# EAGLE design Carriage Board_24V (EAGLE 9.1.3)
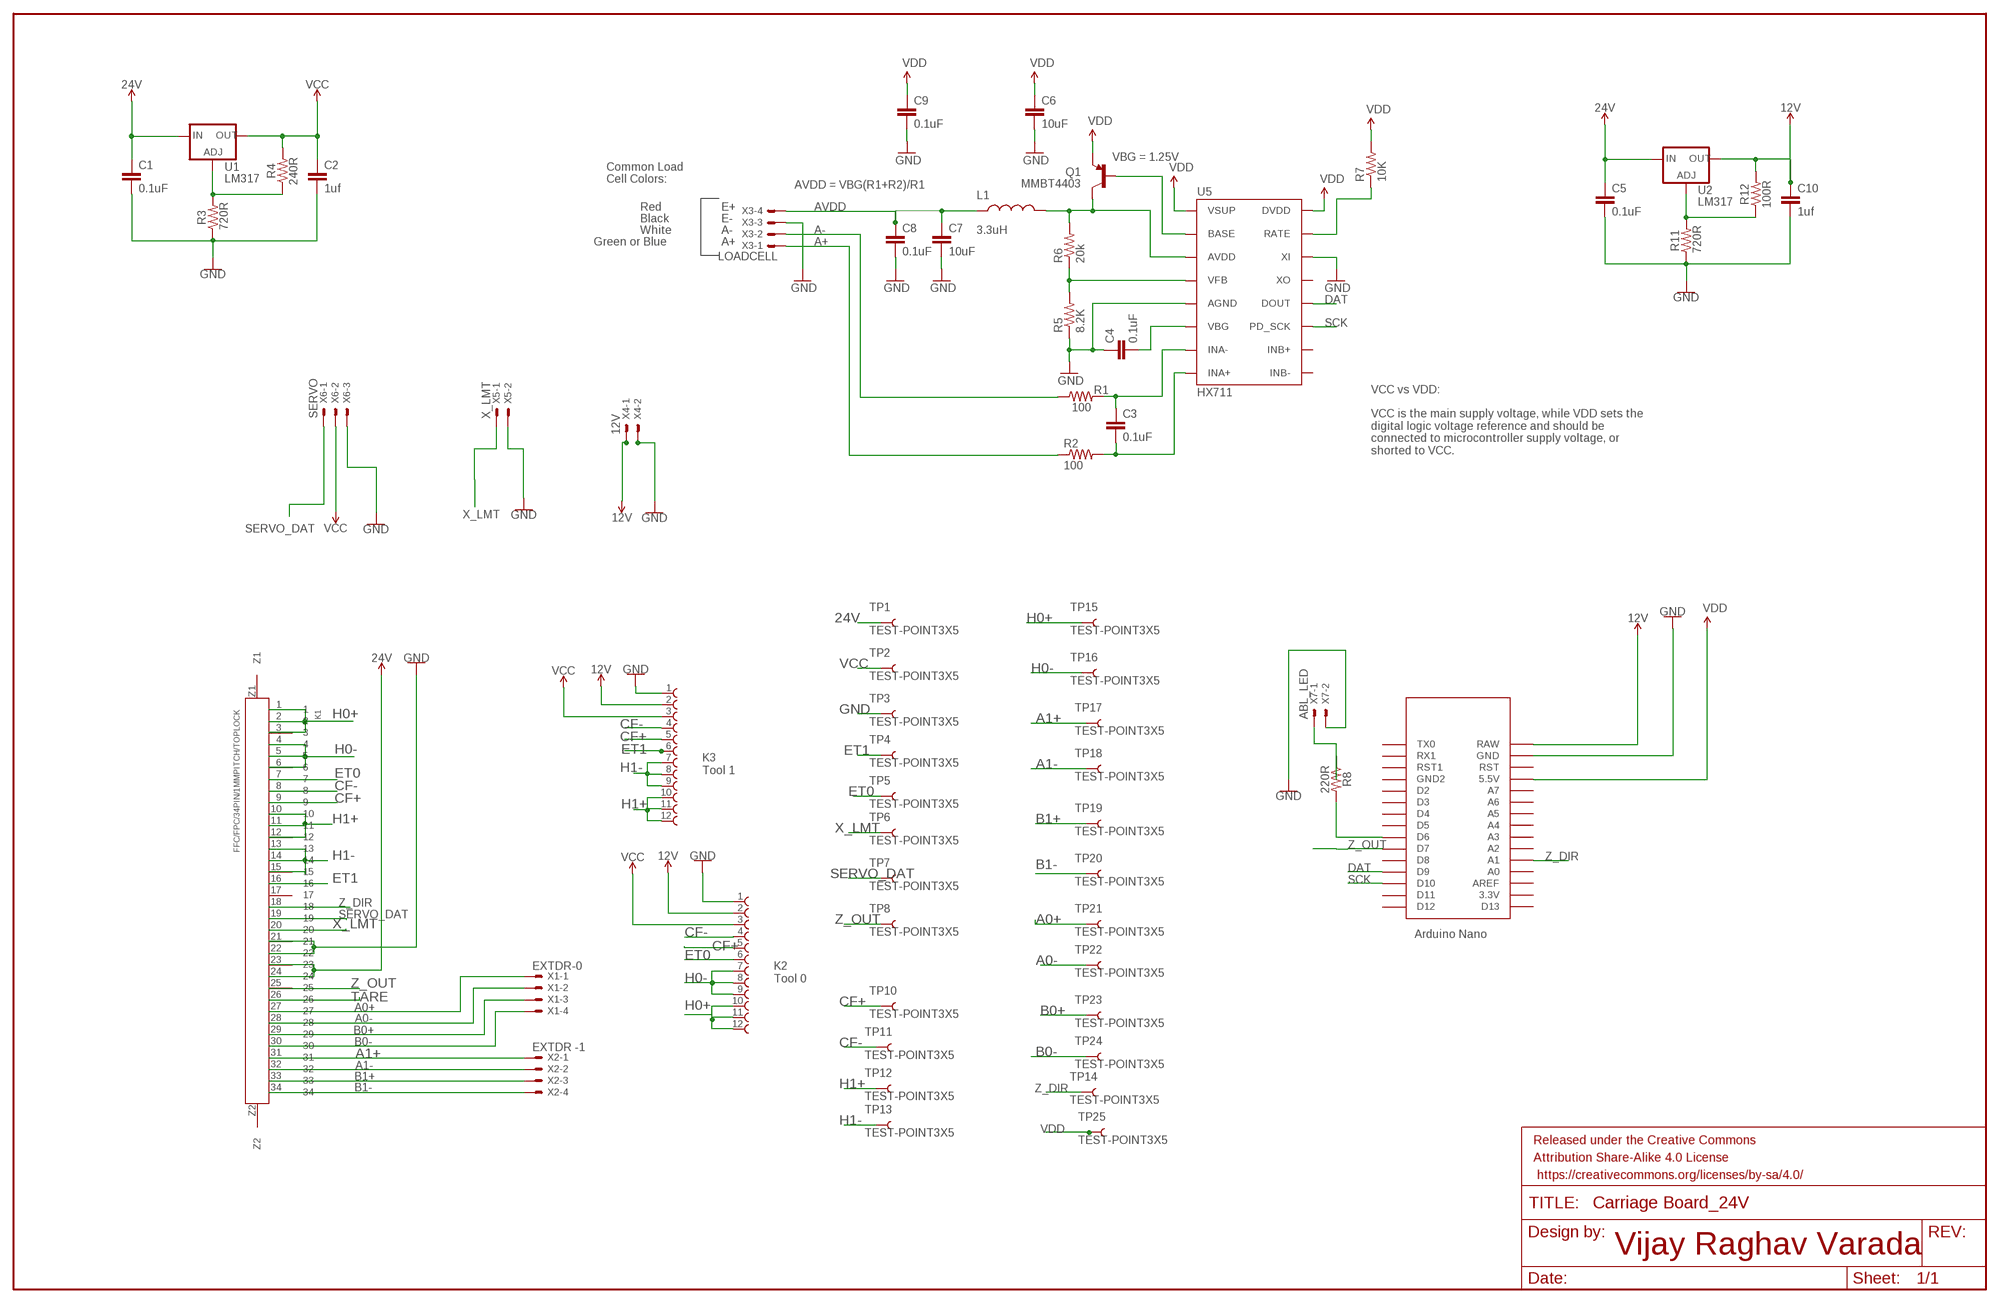
[diagram p0: schematic, sheet 1]

## Parts
C1  0.1uF  9.0PF-0603-50V-10%  [0603]
C2  1uf  9.0PF-0603-50V-10%  [0603]
C3  0.1uF  0.1UF-25V-5%(0603)  [0603-CAP]
C4  0.1uF  0.1UF-25V-5%(0603)  [0603-CAP]
C5  0.1uF  9.0PF-0603-50V-10%  [0603]
C6  10uF  10UF50V20%(1210)  [1210]
C7  10uF  10UF50V20%(1210)  [1210]
C8  0.1uF  0.1UF-25V-5%(0603)  [0603-CAP]
C9  0.1uF  0.1UF-25V-5%(0603)  [0603-CAP]
C10  1uf  9.0PF-0603-50V-10%  [0603]
FRAME1  FRAME-LEDGER  [CREATIVE_COMMONS]
K1  FFC/FPC/34PIN/1MMPITCH/TOPLOCK  [34PIN/1MMPITCH/FFC/FPC]
K2  Tool 0  68611214122  [68611214122]
K3  Tool 1  68611214122  [68611214122]
L1  3.3uH  INDUCTOR0805-IND  [0805]
Q1  MMBT4403  TRANSISTOR_PNPMMBT4403  [SOT23-3]
R1  100  100OHM-1/10W-1%(0603)  [0603-RES]
R2  100  100OHM-1/10W-1%(0603)  [0603-RES]
R3  720R  RESISTOR0603  [0603]
R4  240R  RESISTOR0603  [0603]
R5  8.2K  8.2KOHM-1/10W-5%(0603)  [0603-RES]
R6  20k  20KOHM1/10W1%(0603)  [0603-RES]
R7  10K  10KOHM-1/10W-1%(0603)0603  [0603-RES]
R8  220R  RESISTOR0603  [0603]
R11  720R  RESISTOR0603  [0603]
R12  100R  RESISTOR0603  [0603]
TP1  TEST-POINT3X5  [PAD.03X.05]
TP2  TEST-POINT3X5  [PAD.03X.05]
TP3  TEST-POINT3X5  [PAD.03X.05]
TP4  TEST-POINT3X5  [PAD.03X.05]
TP5  TEST-POINT3X5  [PAD.03X.05]
TP6  TEST-POINT3X5  [PAD.03X.05]
TP7  TEST-POINT3X5  [PAD.03X.05]
TP8  TEST-POINT3X5  [PAD.03X.05]
TP10  TEST-POINT3X5  [PAD.03X.05]
TP11  TEST-POINT3X5  [PAD.03X.05]
TP12  TEST-POINT3X5  [PAD.03X.05]
TP13  TEST-POINT3X5  [PAD.03X.05]
TP14  TEST-POINT3X5  [PAD.03X.05]
TP15  TEST-POINT3X5  [PAD.03X.05]
TP16  TEST-POINT3X5  [PAD.03X.05]
TP17  TEST-POINT3X5  [PAD.03X.05]
TP18  TEST-POINT3X5  [PAD.03X.05]
TP19  TEST-POINT3X5  [PAD.03X.05]
TP20  TEST-POINT3X5  [PAD.03X.05]
TP21  TEST-POINT3X5  [PAD.03X.05]
TP22  TEST-POINT3X5  [PAD.03X.05]
TP23  TEST-POINT3X5  [PAD.03X.05]
TP24  TEST-POINT3X5  [PAD.03X.05]
TP25  TEST-POINT3X5  [PAD.03X.05]
U1  LM317  V_REG_317SMD  [SOT223]
U2  LM317  V_REG_317SMD  [SOT223]
U5  HX711  HX711HX711  [SO16]
U$1  NANO  [NANO]
X1  EXTDR-0  JST-XH-04-PIN-LONG-PAD  [JST-XH-04-PACKAGE-LONG-PAD]
X2  EXTDR -1  JST-XH-04-PIN-LONG-PAD  [JST-XH-04-PACKAGE-LONG-PAD]
X3  LOADCELL  JST-XH-04-PIN-LONG-PAD  [JST-XH-04-PACKAGE-LONG-PAD]
X4  12V  JST-XH-02-PIN-LONG-PAD  [JST-XH-02-PACKAGE-LONG-PAD]
X5  X_LMT  JST-XH-02-PIN-LONG-PAD  [JST-XH-02-PACKAGE-LONG-PAD]
X6  SERVO  JST-XH-03-PIN-LONG-PAD  [JST-XH-03-PACKAGE-LONG-PAD]
X7  ABL_LED  JST-XH-02-PIN-LONG-PAD  [JST-XH-02-PACKAGE-LONG-PAD]

## Nets
12V: C10.1 R12.2 U2.2(OUT) U$1.RAW
24V: C1.1 C5.1 K1.23 K1.24 K2.2 K3.2 TP1.P$1 U1.3(IN) U2.3(IN) X4.1 ; supply symbol labelled 12V
A0+: K1.27 TP21.P$1 X1.1
A0-: K1.28 TP22.P$1 X1.2
A1+: K1.31 TP17.P$1 X2.1
A1-: K1.32 TP18.P$1 X2.2
A+: R2.1 X3.1
A-: R1.1 X3.2
ADJ: R3.2 R4.1 U1.1(ADJ)
ADJ1: R11.2 R12.1 U2.1(ADJ)
AVDD: C7.1 C8.1 L1.1 X3.4
B0+: K1.29 TP23.P$1 X1.3
B0-: K1.30 TP24.P$1 X1.4
B1+: K1.33 TP19.P$1 X2.3
B1-: K1.34 TP20.P$1 X2.4
CF+: K1.9 K2.5 K3.5 TP10.P$1
CF-: K1.8 K2.4 K3.4 TP11.P$1
DAT: U5.12(DOUT) U$1.D9
ET0: K1.7 K2.6 TP5.P$1
ET1: K1.16 K3.6 TP4.P$1
GND: C1.2 C2.2 C4.1 C5.2 C6.2 C7.2 C8.2 C9.2 C10.2 K1.21 K1.22 K2.1 K3.1 R3.1 R5.1 R11.1 TP3.P$1 U5.5(AGND) U5.14(XI) U$1.GND X3.3 X4.2 X5.2 X6.3 X7.2
H0+: K1.1 K1.2 K1.3 K2.10 K2.11 K2.12 TP15.P$1
H0-: K1.4 K1.5 K1.6 K2.7 K2.8 K2.9 TP16.P$1
H1+: K1.10 K1.11 K1.12 K3.10 K3.11 K3.12 TP12.P$1
H1-: K1.13 K1.14 K1.15 K3.7 K3.8 K3.9 TP13.P$1
N$1: R8.2 U$1.D6
N$2: R7.1 U5.15(RATE)
N$3: C3.1 R1.2 U5.7(INA-)
N$4: Q1.1(B) U5.2(BASE)
N$5: L1.2 Q1.3(C) R6.2 U5.3(AVDD)
N$6: R5.2 R6.1 U5.4(VFB)
N$7: C4.2 U5.6(VBG)
N$8: C3.2 R2.2 U5.8(INA+)
N$14: R8.1 X7.1
SCK: U5.11(PD_SCK) U$1.D10
SERVO_DAT: K1.19 TP7.P$1 X6.1
TARE: K1.26
VCC: C2.1 K2.3 K3.3 R4.2 TP2.P$1 U1.2(OUT) X6.2
VDD: C6.1 C9.1 Q1.2(E) R7.2 TP25.P$1 U5.1(VSUP) U5.16(DVDD) U$1.5V(5.5V)
X_LMT: K1.20 TP6.P$1 X5.1
Z_DIR: K1.18 TP14.P$1 U$1.A1
Z_OUT: K1.25 TP8.P$1 U$1.D7
Unconnected: K1.17 K1.Z1 K1.Z2 U5.9(INB-) U5.10(INB+) U5.13(XO) U$1.3.3V U$1.A0 U$1.A2 U$1.A3 U$1.A4 U$1.A5 U$1.A6 U$1.A7 U$1.AREF U$1.D2 U$1.D3 U$1.D4 U$1.D5 U$1.D8 U$1.D11 U$1.D12 U$1.D13 U$1.GND1(GND2) U$1.ICSP1 U$1.ICSP2 U$1.ICSP3 U$1.ICSP4 U$1.ICSP5 U$1.ICSP6 U$1.RST U$1.RST1 U$1.RX1 U$1.TX0

## Notes on the sheet
- VBG = 1.25V
- Common Load
  Cell Colors:
- AVDD = VBG(R1+R2)/R1
- Red | E+
- Black | E-
- White | A-
- Green or Blue | A+
- VCC vs VDD:
  
  VCC is the main supply voltage, while VDD sets the
  digital logic voltage reference and should be
  connected to microcontroller supply voltage, or
  shorted to VCC.
- Vijay Raghav Varada
- C:/Users/Vijay/Dropbox/FracktalWorks/Design & Marketing Colaterals/Box Logo.bmp | C:/Users/Vijay/Dropbox/FracktalWorks/Design & Marketing Colaterals/Box Logo.bmp

## Library data of the parts
C1 C2 C5 C10 = SparkFun-Capacitors:9.0PF: 9.0pF ceramic capacitors A capacitor is a passive two-terminal electrical component used to store electrical energy temporarily in an electric field.; PROD_ID: CAP-09341; VALUE: 9.0pF
C3 C4 C8 C9 = SparkFun-Capacitors:0.1UF-25V-5%(0603): CAP-08604; PROD_ID: CAP-08604
C6 C7 = SparkFun-Capacitors:10UF50V20%(1210): CAP-09824; PROD_ID: CAP-09824
FRAME1 = SparkFun-Aesthetics:FRAME-LEDGER: Schematic Frame - Ledger Standard 11x14 US Ledger frame
K1 = FracktalWorks_Eagle_Library:FFC/FPC/34PIN/1MMPITCH/TOPLOCK
K2 K3 = Wurth_Elektronik_Electromechanic_FPC_Connectors_&_Flat_Flexible_Cable_rev15b:68611214122: WR-FPC 1.00mm SMT ZIF Horizontal Top Contact, 12 Pins=>Code : Con_FPC_ZIF_1.00_68611214122 <http://katalog.we-online.de/media/images/eican/Con_FPC_ZIF_1.00_6861xx14122_pf2.jpg> Details see: http://katalog.we-online.de/en/em/686_1xx_141_22 Created 2014-07-09, Karrer Zheng 2014 (C) Würth Elektronik
L1 = SparkFun-Passives:INDUCTOR: Inductors Basic Inductor/Choke - 0603 and 1206. Footprints are not proven and vary greatly between part numbers. INDUCTOR POWER 3.3UH 4.0A SMD 0.197" L x 0.197" W x 0.177" H (5.00mm x 5.00mm x 4.50mm); PROD_ID: NDUC-13076
Q1 = SparkFun-DiscreteSemi:TRANSISTOR_PNP: Generic PNP BJT Double check pinouts against datasheets- not all devices are the same! MMBT3906 - 40V 200mA SOT-23 (TRANS-08052) MMBT4403 - 40V 600mA SOT-23 (TRANS-09245); PROD_ID: TRANS-09245
R1 R2 = SparkFun-Resistors:100OHM-1/10W-1%(0603): RES-07863; PROD_ID: RES-07863
R3 R4 R8 R11 R12 = SparkFun-Resistors:RESISTOR: Generic Resistor Package
R5 = SparkFun-Resistors:8.2KOHM-1/10W-5%(0603): RES-10646; PROD_ID: RES-10646
R6 = SparkFun-Resistors:20KOHM1/10W1%(0603): RES-09383; PROD_ID: RES-09383
R7 = SparkFun-Resistors:10KOHM-1/10W-1%(0603): RES-00824; PROD_ID: RES-00824
TP1-TP8 TP10-TP25 = SparkFun-Connectors:TEST-POINT: SparkFun Test Points Bare copper test points for troubleshooting or In-Circuit-Testing. These are used by our Production team for verifying production board runs using pogo-pins on test beds. SparkFun Products: SparkFun LSM9DS1 Breakout <https://www.sparkfun.com/products/13284> SparkFun PSOC <https://www.sparkfun.com/products/13714> SparkFun Load Cell Amplifier <https://www.sparkfun.com/products/13879>
U1 U2 = SparkFun-IC-Power:V_REG_317: Voltage Regulator Standard LM317 adjustable voltage regulator. AOI (Adjust Output Input). Google 'LM317 Calculator' for easy to use app to get the two resistor values needed. 240/720 for 5V output. 240/390 for 3.3V output. Spark Fun Electronics SKU : COM-00527
U5 = Testing:HX711; PROD_ID: IC-12445
U$1 = Arduino-clone:NANO: Arduino Nano
X1-X3 = Rembrandt Electronics - JST XH Connectors v1-0:JST-XH-04-PIN: JST XH Connector 2 Pin Wire to board connector. Pitch: 2,54 mm, (0.100") Number of pins: 4 Created by Rembrandt Electronics www.rembrandtelectronics.com
X4 X5 X7 = Rembrandt Electronics - JST XH Connectors v1-0:JST-XH-02-PIN: JST XH Connector 2 Pin Wire to board connector. Pitch: 2,54 mm, (0.100") Number of pins: 2 Created by Rembrandt Electronics www.rembrandtelectronics.com
X6 = Rembrandt Electronics - JST XH Connectors v1-0:JST-XH-03-PIN: JST XH Connector 2 Pin Wire to board connector. Pitch: 2,54 mm, (0.100") Number of pins: 3 Created by Rembrandt Electronics www.rembrandtelectronics.com

## Board
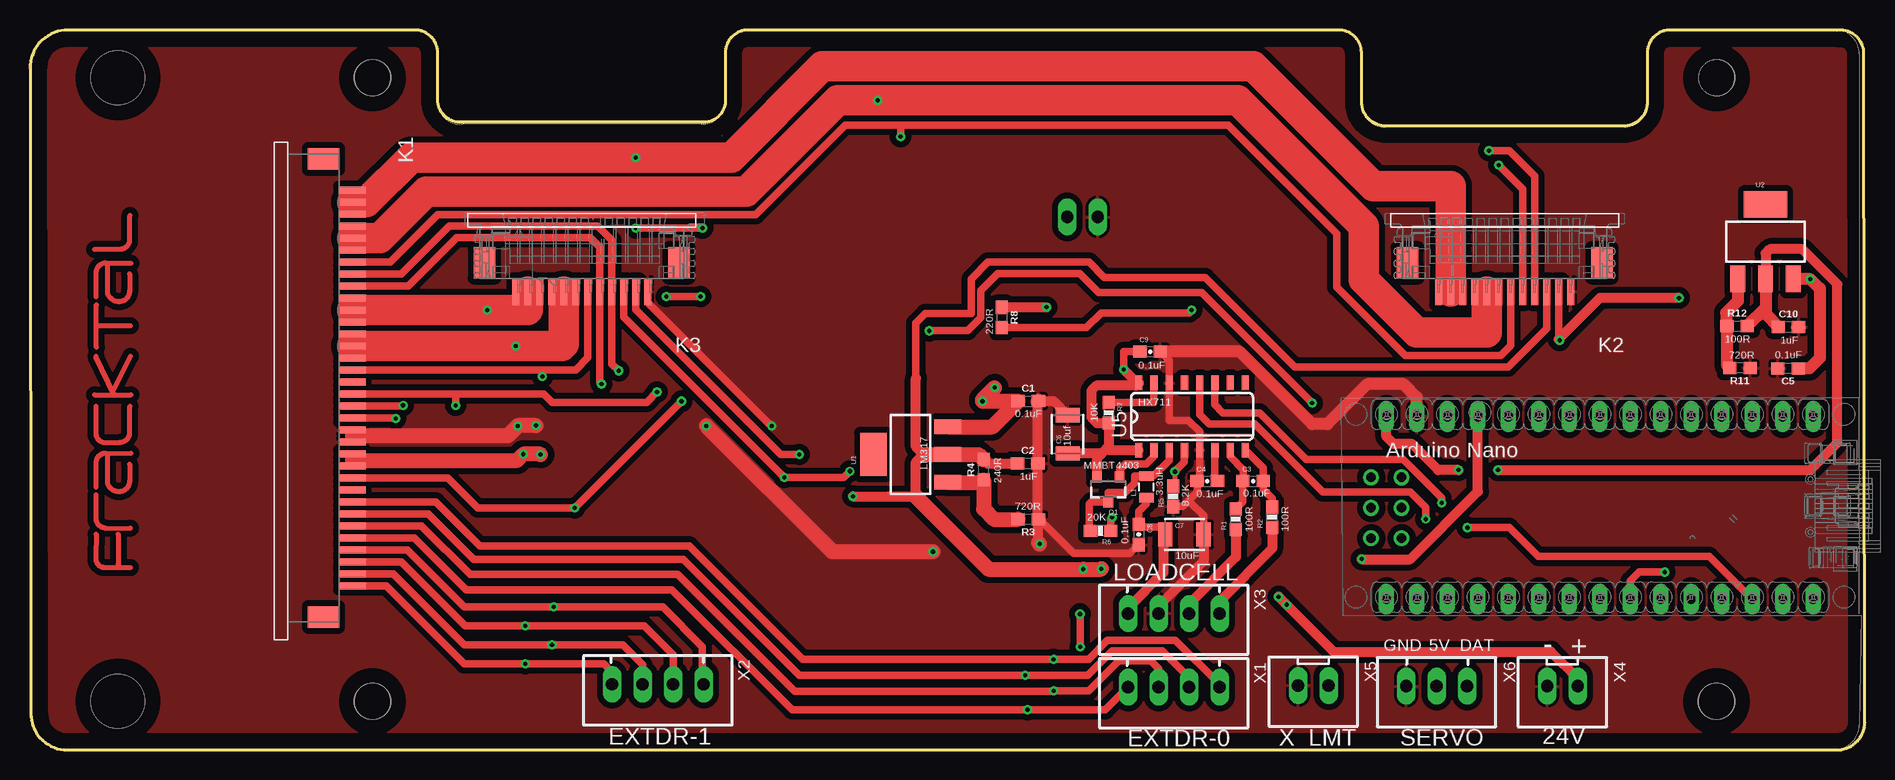
[diagram p1: board, top side]
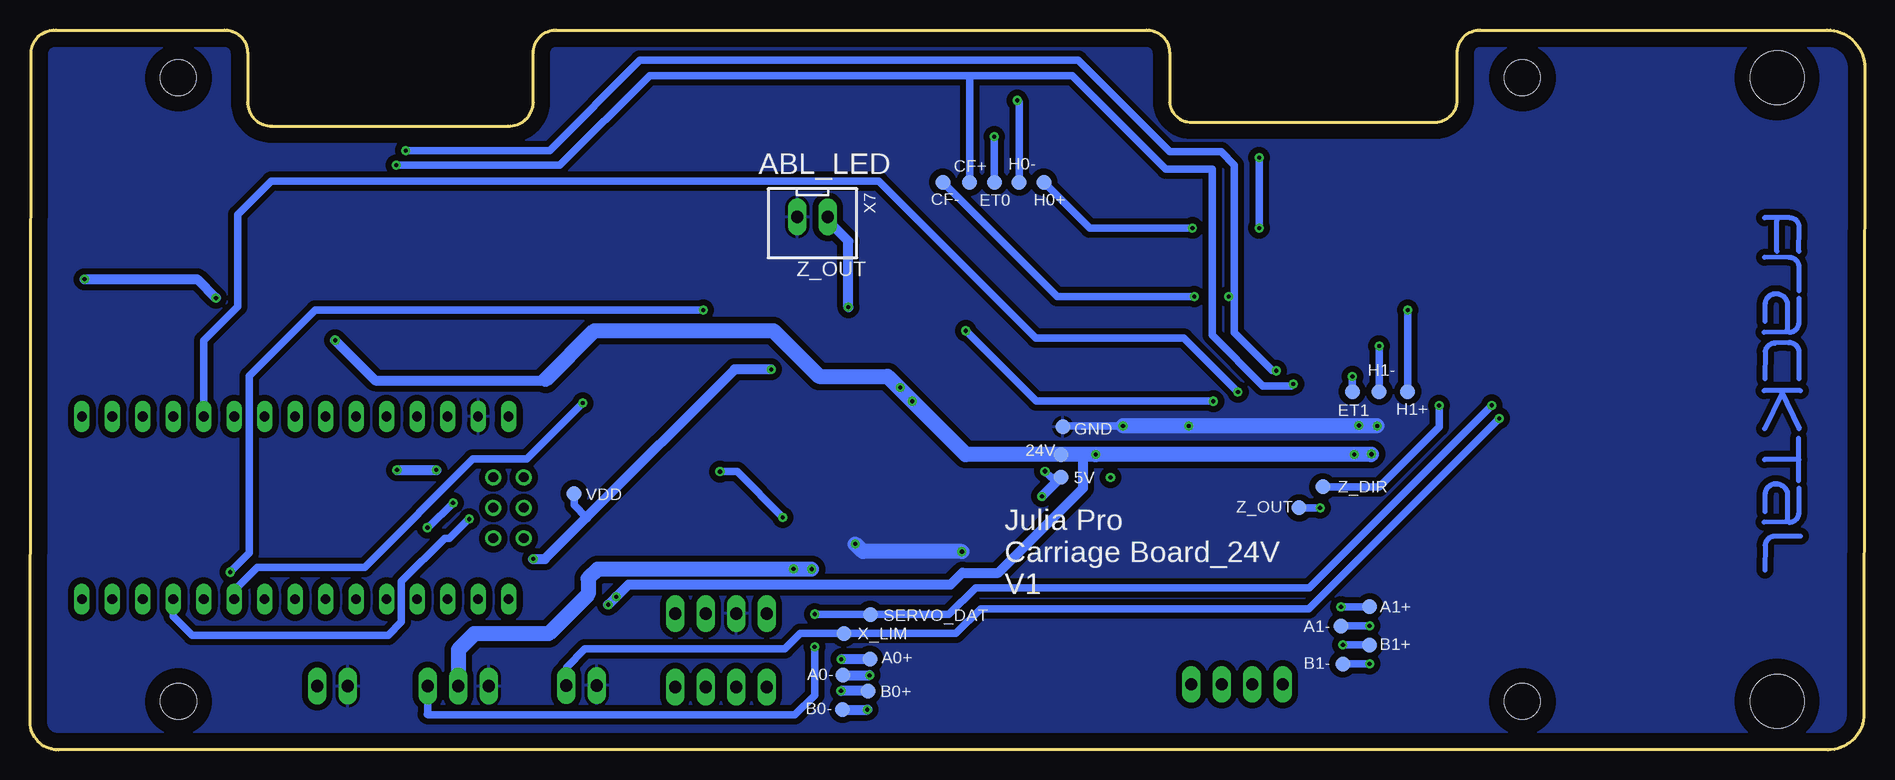
[diagram p2: board, bottom side, seen from below]

Size 152.91 x 60.03 mm. Coordinates in mm from the lower left corner, seen from the top.
Outline: 0,57.02 0,56.86
Outline: 0,56.86 0.08,3.02 arc90 3.09,0 150.51,0 arc90 152.91,2.29 152.81,58.33 arc90 150.57,60.01 136.68,60.03 arc90 134.78,58.13 134.78,54 arc-90 132.74,52.01 113.05,52.01 arc-90 110.97,54 110.97,58.13 arc90 109.06,60.03 59.85,60.03 arc90 57.94,58.13 57.94,54 arc-90 55.96,52.34 36.11,52.34 arc-90 33.97,54 33.97,58.13 arc90 32.07,60.03 3.18,60.03 arc90 0,56.86
Copper layers (1*16): Top 0.035mm / dielectric 1.5mm / Bottom 0.035mm
Design rules "LionCircuits": minimum track width 8mil, minimum drill 0.35mm, track to track 8mil, track to pad 8mil, pad to pad 8mil, via to via 8mil, smd to smd 8mil, copper to edge 50mil, drill to drill 10mil, minimum pad ring 10mil, minimum via ring 8mil, stop-mask expansion 4mil, vias tented up to drill 0mil, thermal gap 10mil
Holes 3 mm at 28.55,56.05 28.55,4.04 140.54,4.04 140.55,56.05
Holes 4.5 mm at 7.32,56.05 7.32,4.06

### Footprints (pad centres in the part's own frame; a part is rotated, then mirrored left to right if it is on the bottom)
0603 = smd 1.1 x 1: 1 -0.85,0; 2 0.85,0
0603-CAP = smd 1.1 x 1: 1 -0.85,0; 2 0.85,0
1210 = smd 1.2 x 2: 1 -1.6,0; 2 1.6,0
34PIN/1MMPITCH/FFC/FPC = smd 0.6 x 2.2: 1 -14.43,2.1; 2 -13.43,2.1; 3 -12.43,2.1; 4 -11.43,2.1; 5 -10.43,2.1; 6 -9.43,2.1; 7 -8.43,2.1; 8 -7.43,2.1; 9 -6.43,2.1; 10 -5.43,2.1; 11 -4.43,2.1; 12 -3.43,2.1; 13 -2.43,2.1; 14 -1.43,2.1; 15 -0.43,2.1; 16 0.57,2.1; 17 1.57,2.1; 18 2.57,2.1; 19 3.57,2.1; 20 4.57,2.1; 21 5.57,2.1; 22 6.57,2.1; 23 7.57,2.1; 24 8.57,2.1; 25 9.57,2.1; 26 10.57,2.1; 27 11.57,2.1; 28 12.57,2.1; 29 13.57,2.1; 30 14.57,2.1; 31 15.57,2.1; 32 16.57,2.1; 33 17.57,2.1; 34 18.57,2.1 | smd 1.8 x 2.6: Z1 -17.03,-0.3; Z2 21.17,-0.3
68611214122 = smd 0.6 x 2.2: 1 -8.5,1.1; 2 -7.5,1.1; 3 -6.5,1.1; 4 -5.5,1.1; 5 -4.5,1.1; 6 -3.5,1.1; 7 -2.5,1.1; 8 -1.5,1.1; 9 -0.5,1.1; 10 0.5,1.1; 11 1.5,1.1; 12 2.5,1.1 | smd 1.8 x 2.6: Z1 -11.1,-1.3; Z2 5.1,-1.3
0805 = smd 0.8 x 1.2: 1 -0.9,0; 2 0.9,0
SOT23-3 = smd 0.8 x 0.9: 1 -0.95,-1; 2 0.95,-1; 3 0,1.1
0603-RES = smd 1.1 x 1: 1 -0.85,0; 2 0.85,0
PAD.03X.05 = smd 1.27 x 1.27: P$1 0,0
SOT223 = smd 1.219 x 2.235: 1 -2.311,-3.099; 2 0,-3.099; 3 2.311,-3.099 | smd 3.6 x 2.2: 4 0,3.099
SO16 = smd 0.6 x 1.2: 1 -4.445,-2.8; 2 -3.175,-2.8; 3 -1.905,-2.8; 4 -0.635,-2.8; 5 0.635,-2.8; 6 1.905,-2.8; 7 3.175,-2.8; 8 4.445,-2.8; 9 4.445,2.8; 10 3.175,2.8; 11 1.905,2.8; 12 0.635,2.8; 13 -0.635,2.8; 14 -1.905,2.8; 15 -3.175,2.8; 16 -4.445,2.8
NANO = drill 0.8 long: 3.3V -10.16,24.13; 5V -10.16,-1.27; A0 -10.16,19.05; A1 -10.16,16.51; A2 -10.16,13.97; A3 -10.16,11.43; A4 -10.16,8.89; A5 -10.16,6.35; A6 -10.16,3.81; A7 -10.16,1.27; AREF -10.16,21.59; D2 5.08,1.27; D3 5.08,3.81; D4 5.08,6.35; D5 5.08,8.89; D6 5.08,11.43; D7 5.08,13.97; D8 5.08,16.51; D9 5.08,19.05; D10 5.08,21.59; D11 5.08,24.13; D12 5.08,26.67; D13 -10.16,26.67; GND -10.16,-6.35; GND1 5.08,-1.27; RAW -10.16,-8.89; RST -10.16,-3.81; RST1 5.08,-3.81; RX1 5.08,-6.35; TX0 5.08,-8.89 | drill 0.8: ICSP1 -5.08,-10.16; ICSP2 -5.08,-7.62; ICSP3 -2.54,-10.16; ICSP4 -2.54,-7.62; ICSP5 0,-10.16; ICSP6 0,-7.62
JST-XH-04-PACKAGE-LONG-PAD = drill 1.016 long: 1 -3.81,0; 2 -1.27,0; 3 1.27,0; 4 3.81,0
JST-XH-02-PACKAGE-LONG-PAD = drill 1.016 long: 1 -1.27,0; 2 1.27,0
JST-XH-03-PACKAGE-LONG-PAD = drill 1.016 long: 1 -2.54,0; 2 0,0; 3 2.54,0

### Placement (x,y rotation side)
C1  83.19,29.08 0 top
C2  83.15,23.9 0 top
C3  101.92,22.41 0 top
C4  98.11,22.41 0 top
C5  146.51,31.82 180 top
C6  86.46,26.32 90 top
C7  96.2,17.96 0 top
C8  92.39,17.96 270 top
C9  93.34,33.2 0 top
C10  146.53,35.27 0 top
FRAME1  22.07,-9.02 0 top  (outside the outline)
K1  24.77,32.25 270 top
K2  119.89,39.31 180 top
K3  42.98,39.31 180 top
L1  93.03,21.93 90 top
Q1  89.85,21.77 180 top
R1  100.49,19.23 90 top
R2  103.5,19.39 90 top
R3  83.19,19.23 180 top
R4  79.48,23.36 90 top
R5  95.25,21.14 90 top
R6  89.22,18.28 180 top
R7  89.89,28.11 270 top
R8  80.96,36.06 270 top
R11  142.49,31.85 180 top
R12  142.27,35.35 0 top
TP1  66.99,24.63 270 bottom
TP2  66.99,22.73 270 bottom
TP3  66.83,26.95 270 bottom
TP4  42.7,29.87 180 bottom
TP5  72.55,47.33 0 bottom
TP6  85.09,9.71 180 bottom
TP7  82.87,11.3 180 bottom
TP8  47.15,20.19 180 bottom
TP10  74.61,47.33 180 bottom
TP11  76.83,47.33 180 bottom
TP12  38.1,29.87 180 bottom
TP13  40.48,29.87 180 bottom
TP14  45.16,21.94 0 bottom
TP15  68.42,47.33 180 bottom
TP16  70.48,47.33 180 bottom
TP17  41.27,11.93 0 bottom
TP18  43.66,10.34 0 bottom
TP19  41.27,8.76 0 bottom
TP20  43.5,7.17 0 bottom
TP21  82.92,7.56 0 bottom
TP22  85.17,6.23 0 bottom
TP23  83.08,4.9 0 bottom
TP24  85.19,3.38 0 bottom
TP25  107.57,21.38 0 bottom
U1  73.38,24.63 90 top
U2  144.63,42.39 0 top
U5  96.84,27.81 0 top
U$1  121.92,17.65 270 top
U$2  [FRACKTALLOGO]  8.48,27.2 90 top
U$3  [FRACKTALLOGO]  8.48,32.38 270 bottom
X1  95.32,5.25 180 top
X2  52.32,5.48 180 top
X3  95.32,11.37 180 top
X4  127.7,5.32 180 top
X5  106.94,5.37 180 top
X6  117.22,5.32 180 top
X7  87.71,44.44 180 bottom

### Tracks (layer width: path | path; a pad name or v marks a point on that pad's centre or on a via)
12V  (via drill 0.35)
  Top 0.813: v119.05,23.34 117.35,23.34 115.19,25.5 113.66,25.5 113.03,26.13 U$1.RAW | v122.33,23.34 148.36,23.34 150.62,25.6 150.62,38.83 147.7,41.75 144.98,41.75 144.63,41.4 U2.2
  Top 1.016: U2.2 144.63,36.86 | 144.63,36.86 R12.2 | 144.63,36.86 144.63,36.33 C10.1
  Bottom 0.813: v122.33,23.34 v119.05,23.34
24V  (via drill 0.35)
  Top 0.508: K1.23 26.87,24.16 K1.24
  Top 0.61: v64.11,24.63 62.55,24.63 50.48,36.7 K3.2 | K2.2 127.39,34.24
  Top 0.813: v127.48,34.16 127.39,34.24 130.83,37.69 v137.41,37.69 | v104.04,12.77 104.07,12.77 108.65,8.19 126.74,8.19 128.97,5.95 X4.1
  Top 1.016: U2.3 146.96,39.26 v148.36,39.26 149.15,38.47 149.15,32.68 148.28,31.82 C5.1
  Top 1.27: U1.3 80.2,26.94 C1.1 v79.38,29.08 79.38,29.2 v80.39,30.22 | 26.87,24.16 40.61,24.16 v41.12,24.66 42.51,24.66 v42.54,24.63
  Bottom 0.813: TP1.P$1 v64.11,24.63 | v127.48,34.16 124.14,30.82 110.01,30.82 109.93,30.9 | 65.15,24.63 65.15,21.84 72.21,14.78 75.21,14.78 76.19,13.8 103.01,13.8 v104.04,12.77 104.06,12.77 v104.72,12.11 | v148.36,39.26 138.99,39.26 v137.41,37.69
  Bottom 1.27: 109.93,30.9 105.89,34.95 90.96,34.95 87.15,31.14 81.44,31.14 v79.38,29.08 74.93,24.63 65.15,24.63 v64.11,24.63 41.15,24.63 v41.12,24.66
A0+  (via drill 0.35)
  Top 0.61: K1.27 33.79,20.68 37.46,17.01 54.93,17.01 64.38,7.56 v85.3,7.56 88.22,7.56 89.79,9.13 95.45,9.13 99.13,5.46 X1.1
  Bottom 0.813: TP21.P$1 v85.3,7.56
A0-  (via drill 0.35)
  Top 0.61: K1.28 33.21,19.68 36.99,15.9 54.45,15.9 64.12,6.23 v82.94,6.23 88.13,6.23 90.17,8.27 94.33,8.27 96.59,6.02 X1.2
  Bottom 0.813: TP22.P$1 v82.94,6.23
A1+  (via drill 0.35)
  Top 0.61: K1.31 31.45,16.68 36.2,11.93 v43.66,11.93 52.72,11.93 56.04,8.61 56.04,5.39 X2.1
  Bottom 0.61: TP17.P$1 v43.66,11.93
A1-  (via drill 0.35)
  Top 0.61: K1.32 30.92,15.68 36.26,10.34 v41.27,10.34 51.17,10.34 53.59,7.92 X2.2
  Bottom 0.61: TP18.P$1 v41.27,10.34
A+
  Top 0.813: R2.1 103.5,16.78 99.13,12.41 X3.1
A-
  Top 0.813: R1.1 100.49,16.09 96.59,12.18 X3.2
ADJ
  Top 1.27: U1.1 79.28,22.32 R4.1 79.48,20.08 80.33,19.23 R3.2
ADJ1
  Top 1.016: U2.1 142.32,37.43 141.35,36.47 141.35,35.41 R12.1 141.41,32.07 R11.2
AVDD
  Top 0.61: C7.1 94.6,18.59 92.62,18.59 C8.1 92.39,19.87 93.03,20.5 L1.1
  Top 0.813: C7.1 arc90 94.46,17.82 94.46,14.79 91.51,11.84 X3.4
B0+  (via drill 0.35)
  Top 0.61: K1.29 32.62,18.68 36.67,14.63 53.97,14.63 63.73,4.87 85.27,4.87 v85.33,4.92 88.22,4.92 90.73,7.42 93.41,7.42 94.05,6.78 X1.3
  Bottom 0.813: v85.33,4.92 83.1,4.92 TP23.P$1
B0-  (via drill 0.35)
  Top 0.61: K1.30 32.03,17.68 36.35,13.36 53.5,13.36 63.52,3.33 83.1,3.33 v83.13,3.36 89.62,3.36 X1.4
  Bottom 0.813: v83.13,3.36 85.17,3.36 TP24.P$1
B1+  (via drill 0.35)
  Top 0.61: K1.33 30.27,14.68 36.2,8.76 v43.5,8.76 49.4,8.76 51.04,7.11 X2.3
  Bottom 0.61: TP19.P$1 v43.5,8.76
B1-  (via drill 0.35)
  Top 0.61: K1.34 29.68,13.68 36.2,7.17 v41.27,7.17 47.81,7.17 48.49,6.49 48.49,5.49 X2.4
  Bottom 0.61: TP20.P$1 v41.27,7.17
CF+  (via drill 0.35)
  Top 0.61: K1.9 31.51,38.68 35.55,42.72 46.68,42.72 47.48,41.92 K3.5 47.47,30.66 v47.62,30.51 | K2.5 124.39,46.77 v122.4,48.76
  Bottom 0.61: v122.4,48.76 108.74,48.76 101.28,56.22 74.61,56.22 | 74.61,56.22 66.04,56.22 58.26,48.44 54.4,48.44 54.4,34.58 50.16,30.35 47.78,30.35 v47.62,30.51 | 74.61,56.22 TP10.P$1
CF-  (via drill 0.35)
  Top 0.61: K1.8 30.93,39.68 34.92,43.68 47.31,43.68 48.48,42.51 K3.4 48.48,32.19 v49.05,31.62 | K2.4 125.39,47.83 123.27,49.96 121.61,49.96 v121.58,49.98 | v55.88,37.81 v53.02,37.81
  Bottom 0.61: 52.55,37.81 52.55,48.76 53.66,49.87 57.94,49.87 65.56,57.49 102.08,57.49 109.61,49.96 121.56,49.96 v121.58,49.98 | 52.55,37.81 52.55,34.79 49.37,31.62 v49.05,31.62 | TP11.P$1 67.31,37.81 v55.88,37.81 | v53.02,37.81 52.55,37.81
DAT  (via drill 0.35)
  Top 0.61: U5.12 97.47,27.97 98.27,27.17 102.08,27.17 107.74,21.51 115.04,21.51 116.31,20.24 v116.31,19.25
  Bottom 0.61: U$1.D9 140.97,11.14 139.4,9.57 123.06,9.57 121.97,10.66 121.97,14.04 118.36,17.65 117.96,17.65 116.36,19.25 v116.31,19.25
ET0  (via drill 0.35)
  Top 0.61: K1.7 30.02,40.68 33.97,44.63 60.48,44.63 67.94,52.1 72.55,52.1 | 72.55,52.1 99.85,52.1 108.9,43.05 108.9,38.6 114.62,32.89 122.55,32.89 123.39,33.72 K2.6 | v72.55,51.14 72.55,52.1
  Bottom 0.61: TP5.P$1 v72.55,51.14
ET1  (via drill 0.35)
  Top 0.61: K1.16 42.7,31.68 | 42.7,31.68 45.47,31.68 46.49,32.71 46.49,38.19 K3.6 | v42.7,31.14 42.7,31.68
  Bottom 0.61: TP4.P$1 v42.7,31.14
GND  (via drill 0.35)
  Top 0.406: K1.21 26.87,26.22 K1.22
  Top 0.61: R5.1 96.04,20.29 96.36,20.61 | 96.36,20.61 96.73,20.61 97.8,19.54 C7.2 | C9.2 94.93,32.47 U5.14 94.93,27.49 96.52,27.49 97.47,26.54 U5.5 97.47,22.62 C4.1 97.26,21.5 96.36,20.61 | C8.2 91.66,16.38 87,16.38 84.14,19.23 R3.1 | K3.1 51.48,37.29 61.75,27.01 v61.82,27.01
  Top 0.813: 84.03,17.27 R3.1 83.98,19.28 83.98,23.67 84.1,23.79 C2.2 84,29.04 | C7.2 97.8,15.75 94.05,12 X3.3 | C1.2 85.31,29.08 C6.2
  Top 1.016: U$1.GND 115.57,29.39 114.46,30.51 111.44,30.51 108.11,27.17 106.84,27.17 100.81,33.2 C9.2
  Top 1.27: 26.87,26.22 39.85,26.22 v40.64,27.01 40.67,27.04 v42.16,27.04 | v56.36,27.01 66.83,16.54 v75.25,16.54 | v84.14,17.17 84.03,17.27 | 84,29.04 C1.2
  Bottom 0.61: v61.82,27.01 66.77,27.01 TP3.P$1
  Bottom 1.27: v40.64,27.01 v56.36,27.01 v61.82,27.01 | v75.25,16.54 83.5,16.54 v84.14,17.17
  pour Top (isolate 0.508): 0.86,59.3 33.63,59.3 33.63,51.96 58.45,51.96 58.45,59.48 110.95,59.48 110.95,51.84 135.43,51.84 135.43,59.53 152.91,59.53 152.91,-0.59 0.86,-0.59
  pour Bottom (isolate 0.508): 0.79,59.05 33.81,59.05 33.81,52.01 58.62,52.01 58.62,59.66 110.95,59.66 110.95,51.84 135.41,51.84 135.41,59.23 153.01,59.23 153.01,-0.46 0.79,-0.46
H0+  (via drill 0.35)
  Top 0.406: K1.3 K1.1 K1.2 | K2.12 K2.11 K2.10
  Top 0.61: v56.04,43.52 v50.48,43.52
  Top 2.54: K1.2 28.04,45.68 31.75,49.4 v50.48,49.4 58.42,49.4 66.04,57.02 101.92,57.02 111.92,47.02 118.39,47.02 K2.11
  Bottom 0.61: TP15.P$1 64.61,43.52 v56.04,43.52 | v50.48,43.52 v50.48,49.4
H0-  (via drill 0.35)
  Top 0.61: K1.6 K1.4 K1.5 | K2.9 K2.8 K2.7
  Top 2.54: K1.5 29.16,42.68 33.02,46.54 59.69,46.54 67.31,54.16 v70.64,54.16 100.65,54.16 111.12,43.68 111.12,39.24 115.57,34.79 121.4,34.79 121.4,38.2 K2.8
  Bottom 0.61: TP16.P$1 70.48,54 v70.64,54.16
H1+  (via drill 0.35)
  Top 0.406: K1.12 K1.10 K1.11 | K3.12 K3.11 K3.10
  Top 2.54: K1.11 v38.1,36.68 41.48,36.68 K3.11
  Bottom 0.61: TP12.P$1 v38.1,36.68
H1-  (via drill 0.35)
  Top 0.406: K1.15 K1.13 K1.14 | K3.9 K3.8 K3.7
  Top 2.54: K3.8 44.48,33.87 44.29,33.68 v40.48,33.68 K1.14
  Bottom 0.61: TP13.P$1 v40.48,33.68
N$1  (via drill 0.35)
  Top 0.61: R8.2 88.02,35.21 89.26,36.44 96.62,36.44 96.8,36.62 v96.8,36.67 | v136.22,14.83 134.09,14.83 133.35,14.09 U$1.D6
  Bottom 0.61: v96.8,36.67 129.13,36.67 134.62,31.18 134.62,16.43 v136.22,14.83
N$2
  Top 0.61: R7.1 93.66,28.96 U5.15
N$3
  Top 0.61: U5.7 100.01,24.47 101.12,23.36 101.12,22.47 C3.1 101.07,20.66 R1.2
N$4
  Top 0.61: Q1.1 90.8,23.36 91.28,23.84 93.03,23.84 93.66,24.47 U5.2
N$5
  Top 0.61: U5.3 94.93,24.16 93.61,22.83 L1.2 92.08,22.83 92.08,22.25 91.28,21.46 89.85,21.46 Q1.3 88.44,20.67 88.27,20.5 88.27,18.38 R6.2
N$6  (via drill 0.35)
  Top 0.406: v95.41,23.2 95.41,22.15
  Top 0.61: U5.4 96.2,24 v95.41,23.2 | v90.17,19.39 90.07,19.29 R6.1 | 95.41,22.15 R5.2
  Bottom 0.61: v90.17,19.39 93.98,23.2 v95.41,23.2
N$7
  Top 0.61: U5.6 98.74,22.62 C4.2
N$8
  Top 0.61: U5.8 102.77,23.52 C3.2 102.77,21.72 103.5,20.98 R2.2
N$14  (via drill 0.35)
  Top 0.813: R8.1 84.69,36.91 v84.71,36.93 | R8.1 81.06,37.01 R8.1
  Bottom 0.813: X7.1 86.44,44.14 84.71,42.41 v84.71,36.93
SCK  (via drill 0.35)
  Top 0.61: U5.11 98.74,28.78 99.42,28.11 102.47,28.11 106.35,24.23 114.44,24.23 117.65,21.02 v117.65,20.59 | v119.79,18.54 123.29,18.54 125.68,16.15 139.93,16.15 U$1.D10
  Bottom 0.61: v117.65,20.59 119.71,18.54 v119.79,18.54
SERVO_DAT  (via drill 0.35)
  Top 0.61: K1.19 31.04,28.68 v31.09,28.73 | v87.5,11.32 87.5,8.63 v87.53,8.6
  Bottom 0.61: v31.09,28.73 46.32,13.51 74.09,13.51 74.1,13.52 76.33,11.3 TP7.P$1 87.48,11.3 v87.5,11.32 | v87.53,8.6 87.53,4.57 89.18,2.92 119.72,2.92 119.79,2.99 119.75,3.02 X6.1
VCC  (via drill 0.35)
  Top 0.61: K3.3 49.48,36.11 v62.86,22.73 67.82,22.73 v68.33,23.23 | K2.3 126.39,35.13 123.19,31.93 105.41,31.93 97.95,39.4 89.53,39.4 88.27,40.67 79.82,40.67 78.42,39.27 78.42,36.38 74.61,36.38 73.82,35.59 73.82,30.98 | R4.2 79.81,23.88 | 82.28,23.88 C2.1
  Top 0.813: v68.58,21.14 73.82,21.14 73.82,24 74.45,24.63 73.82,25.27 73.82,30.98 | 79.81,23.88 82.28,23.88
  Top 1.27: R4.2 79.06,24.63 U1.2 74.45,24.63 | 73.82,21.14 79.89,15.07 v87.77,15.07 89.25,15.07 v89.28,15.11
  Bottom 0.61: v68.33,23.23 67.82,22.73 TP2.P$1
  Bottom 0.813: TP2.P$1 v68.58,21.14
  Bottom 1.27: v87.77,15.07 105.6,15.07 106.39,14.29 106.39,12.99 109.69,9.69 115.89,9.69 117.22,8.36 X6.2
VDD  (via drill 0.35)
  Top 0.406: 91.17,31.7 v91.15,31.72 | 92.29,30.58 92.42,30.58
  Top 0.61: C9.1 91.15,33.2 v91.15,31.72 | 89.95,25.01 89.89,25.06 89.76,25.19
  Top 0.813: v110.98,15.92 110.98,15.9 115,15.9 120.65,21.55 U$1.5V | 91.17,31.7 92.29,30.58 | 92.42,30.58 U5.16 92.16,30.38 88.86,30.38 88.44,29.97 88.44,27.73 88.91,27.26 R7.2 89.89,25.06 | 89.95,25.01 U5.1 | 89.76,25.19 89.29,24.72 | 89.29,24.72 C6.1 | Q1.2 88.9,24.33 89.29,24.72
  Bottom 0.61: TP25.P$1 107.57,20.42 106.53,19.38
  Bottom 0.813: v110.98,15.92 110,15.92 106.53,19.38 94.19,31.72 v91.15,31.72
X_LMT  (via drill 0.35)
  Top 0.61: K1.20 30.45,27.68 v30.48,27.65
  Bottom 0.61: v30.48,27.65 46.35,11.77 73.68,11.77 75.74,9.71 TP6.P$1 88.72,9.71 90.02,8.41 106.67,8.41 108.19,6.89 108.19,5.39 X5.1
Z_DIR  (via drill 0.35)
  Top 0.61: K1.18 35.46,29.68 | 35.46,29.68 42.83,29.68 43.54,28.97 51.38,28.97 v52.25,29.84 | 35.46,29.68 35.46,28.75 v35.48,28.72
  Bottom 0.61: v52.25,29.84 56.77,34.36 69.11,34.36 82.17,47.42 132.82,47.42 135.61,44.62 135.61,36.95 138.43,34.13 U$1.A1 | v35.48,28.72 35.48,26.94 40.49,21.94 TP14.P$1
Z_OUT  (via drill 0.35)
  Top 0.61: K1.25 34.81,22.68 37.31,20.19 v45.4,20.19 v54.29,29.08 | v106.84,28.92 97.63,38.13 89.06,38.13 87.47,39.71 80.64,39.71 79.23,38.3 79.23,36.04 78.14,34.95 v74.93,34.95
  Bottom 0.61: v54.29,29.08 69.06,29.08 v74.93,34.95 | TP8.P$1 v45.4,20.19 | U$1.D7 135.89,13.3 133.96,15.23 125.02,15.23 116,24.25 111.51,24.25 v106.84,28.92

### Text on the board
tPlace: 220R | 100R | 1uF | 720R | 0.1uF | 0.1uF | 10K | HX711 | 0.1uF | 10uf | 240R | Arduino Nano | LM317 | MMBT4403 | 1uF | 0.1uF | 720R | 3.3uH | 8.2K | 0.1uF | 20K | 100R | 100R | 0.1uF | 10uF | LOADCELL | GND | 5V | DAT | - | + | EXTDR-1 | EXTDR-0 | X_LMT | SERVO | 24V
bPlace: H0- | CF+ | ABL_LED | H0+ | ET0 | CF- | Z_OUT | H1- | H1+ | ET1 | GND | 24V | Z_DIR | 5V | VDD | Z_OUT | Julia Pro / Carriage Board_24V / V1 | A1+ | SERVO_DAT | A1- | B1+ | X_LIM | B1- | A0+ | A0- | B0+ | B0-
tDocu: Vijay Raghav Varada